# EAGLE design PCB-PWR-FP-35-1.1-in-wall-IoT-FilPilote-Power-Board (EAGLE 7.4.0)
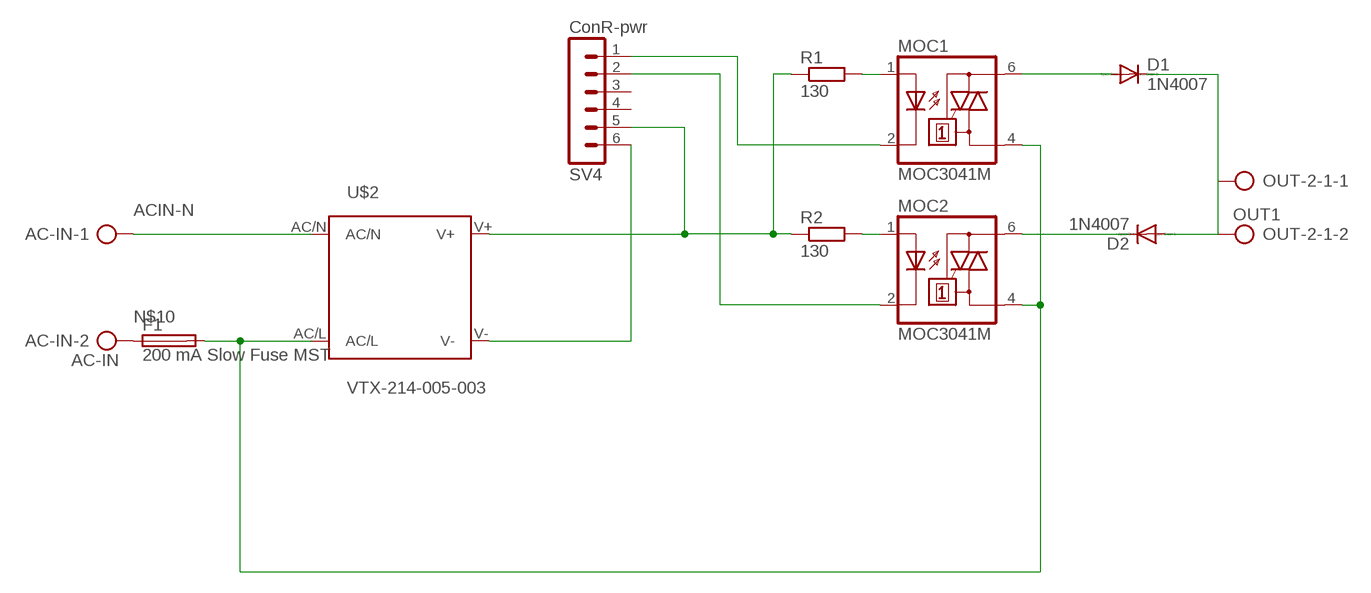
[diagram p0: schematic, sheet 1]

## Parts
AC-IN  AC-IN  AK500/2-H  [AK500/2-H]
D1  1N4007  1N4004  [DO41-10]
D2  1N4007  1N4004  [DO41-10]
F1  200 mA Slow Fuse MST  FUSETE5  [TE5]
MOC1  MOC3041M  [DIL06]
MOC2  MOC3041M  [DIL06]
OUT-2-1  OUT1  AK500/2-H  [AK500/2-H]
R1  130  R-EU_R1206W  [R1206W]
R2  130  R-EU_R1206W  [R1206W]
SV4  ConR-pwr  MA06-1  [MA06-1]
U$2  VTX-214-005-003  [VTX-214-005-003]

## Nets
ACIN-L: F1.2 MOC1.4(A1) MOC2.4(A1) U$2.AC/L
ACIN-N: AC-IN.1 U$2.AC/N
N$1: D1.C D2.A OUT-2-1.1 OUT-2-1.2
N$3: D1.A MOC1.6(A2)
N$4: SV4.6 U$2.V-
N$5: D2.C MOC2.6(A2)
N$6: MOC1.2(C) SV4.1
N$7: MOC2.2(C) SV4.2
N$8: MOC1.1(A) R1.2
N$9: MOC2.1(A) R2.2
N$10: AC-IN.2 F1.1
N$19: R1.1 R2.1 SV4.5 U$2.V+
Unconnected: SV4.3 SV4.4

## Library data of the parts
AC-IN OUT-2-1 = con-ptr500:AK500/2-H: CONNECTOR Aug. 2004 / PTR Meßtechnik: Die Bezeichnung der Serie AK505 wurde geändert. Es handelt sich hierbei um AK500 in horizontaler Ausführung.; OC_FARNELL: unknown; OC_NEWARK: unknown
D1 D2 = diode:1N4004: DIODE general purpose rectifier, 1 A
F1 = fuse:FUSE: Fuse; OC_FARNELL: unknown; OC_NEWARK: unknown
MOC1 MOC2 = optocoupler:MOC30*: 6-Pin DIP Zero-Cross Optoisolators Triac Driver Output (250/400 Volt Peak) Source: Data sheet <http://www.fairchildsemi.com/ds/MO/MOC3031M.pdf> The old path of data sheet not more available 2013-05-06.; MF: FAIRCHILD SEMICONDUCTOR; MPN: MOC3041M; OC_FARNELL: 1086677; OC_NEWARK: 78K6090
R1 R2 = resistor:R-EU_: RESISTOR, European symbol
SV4 = con-lstb:MA06-1: PIN HEADER; OC_FARNELL: unknown; OC_NEWARK: unknown
U$2 = VTX-214-005-003 - TMPS 03 103:VTX-214-005-003: 5 watt 3.3v 1500mA

## Board
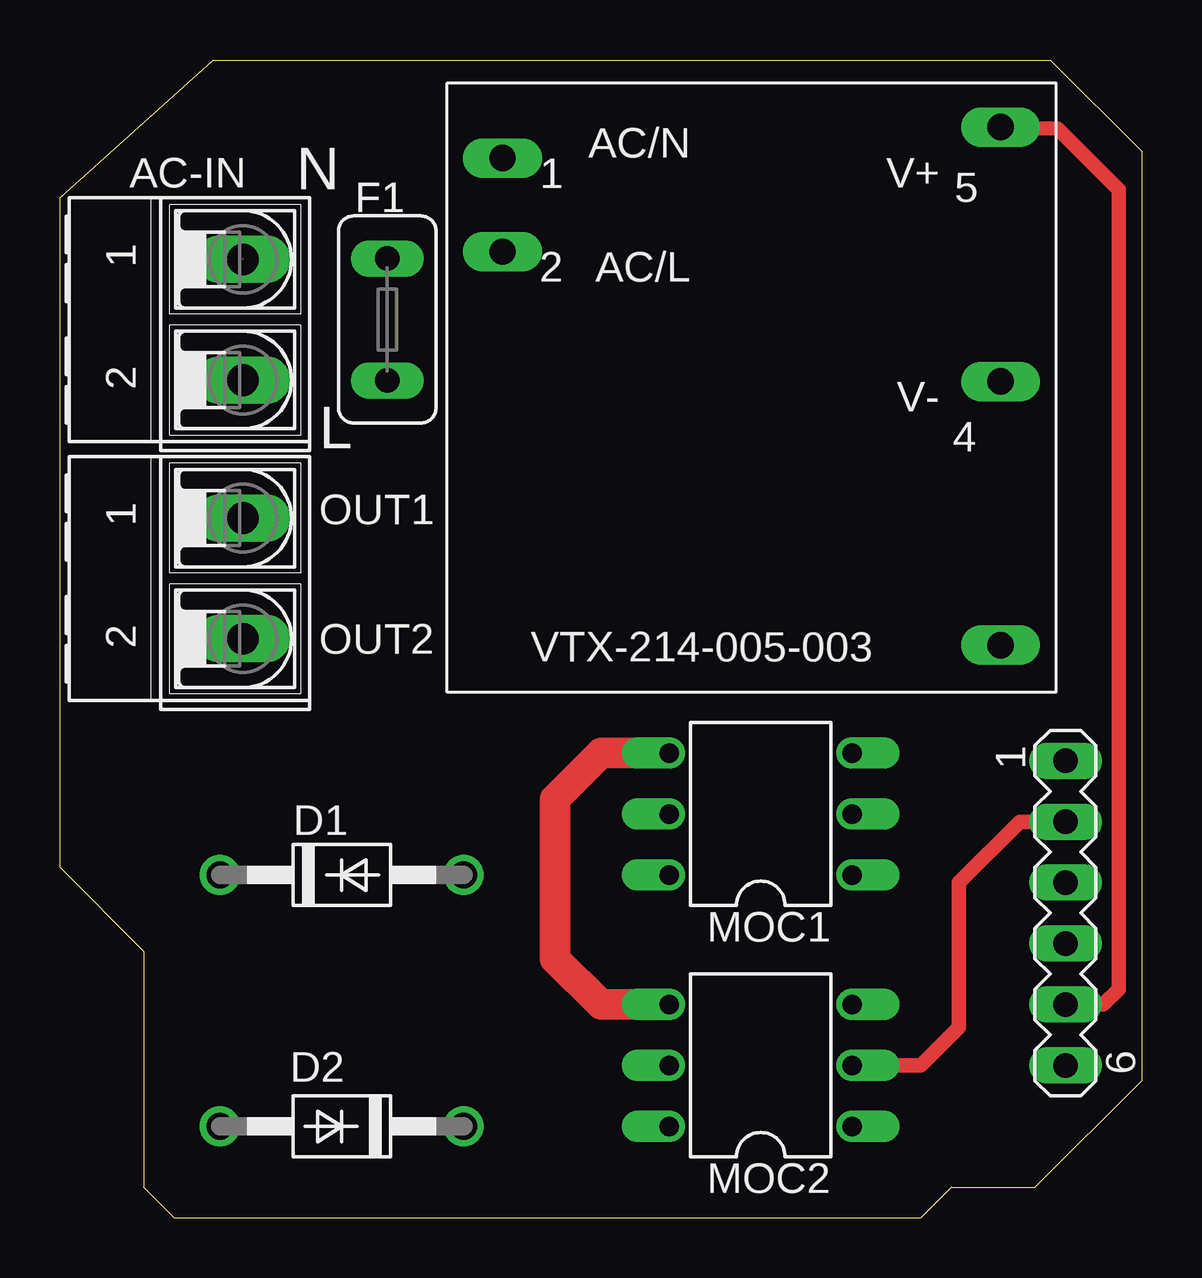
[diagram p1: board, top side]
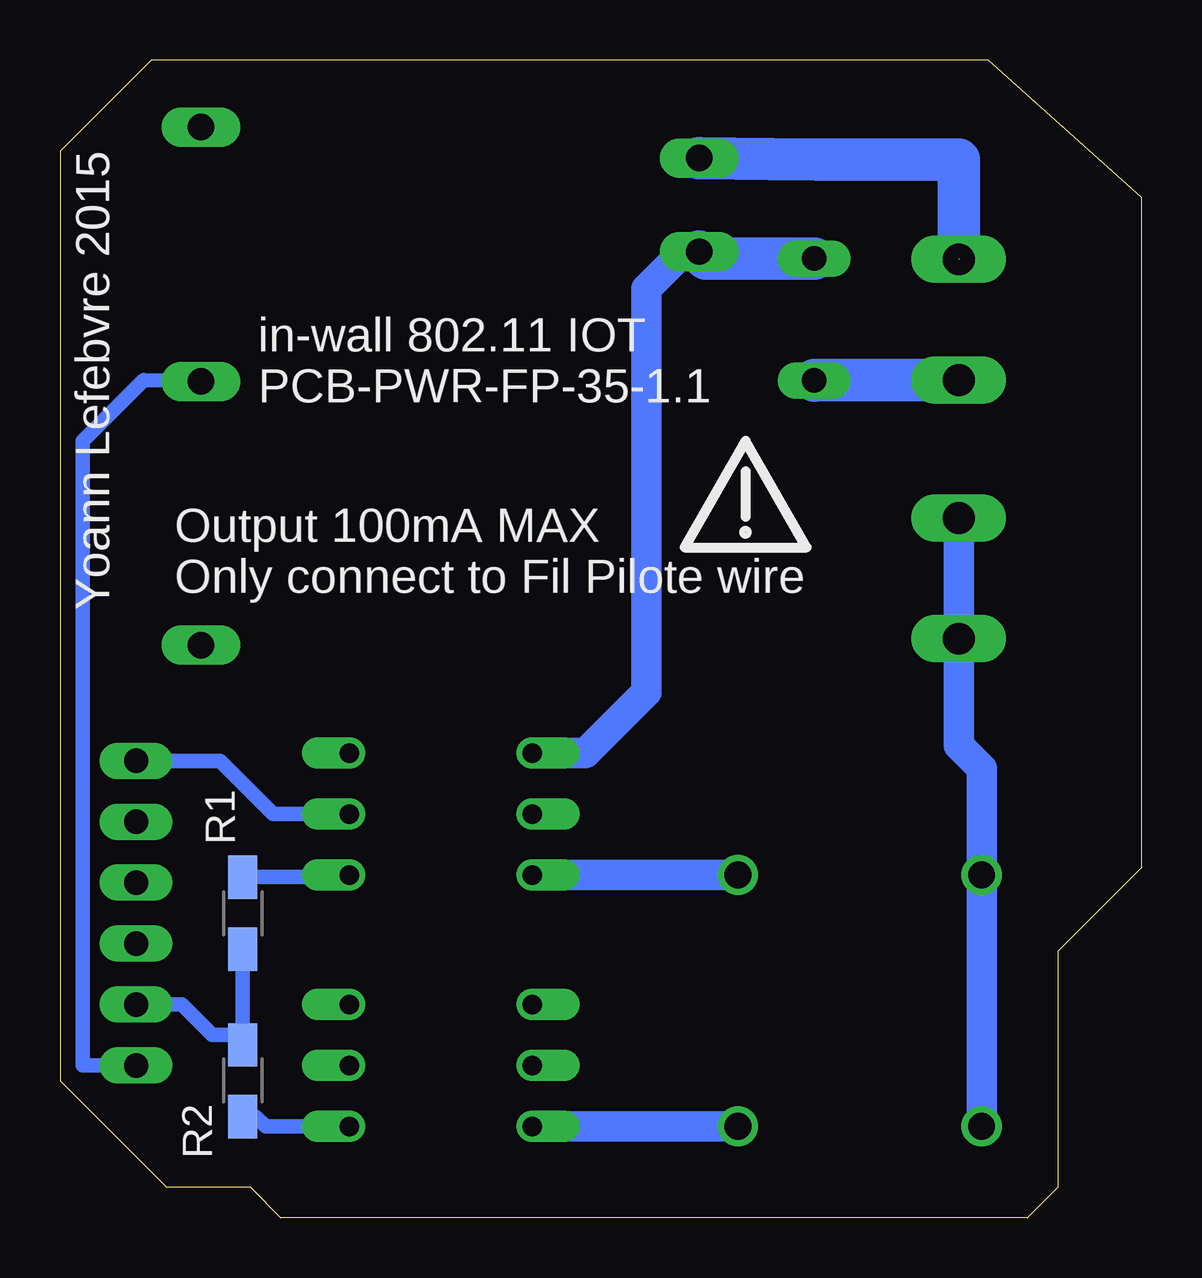
[diagram p2: board, bottom side, seen from below]

Size 45.09 x 48.26 mm. Coordinates in mm from the lower left corner, seen from the top.
Outline: 6.39,48.26 41.27,48.26 45.09,44.45 45.09,5.71 40.64,1.27 37.15,1.27 35.88,0 4.76,0 3.49,1.27 3.49,11.11 0,14.61 0,42.52 6.39,48.26
Copper layers (1*16): Top 0.035mm / dielectric 1.5mm / Bottom 0.035mm
Design rules "dirt_cheap_dirty_boards.v1": minimum track width 5mil, minimum drill 12mil, track to track 5mil, track to pad 5mil, pad to pad 5mil, via to via 5mil, smd to smd 0mil, copper to edge 10mil, drill to drill 10mil, minimum pad ring 10mil, minimum via ring 6mil, stop-mask expansion 2mil, vias tented up to drill 25mil, thermal gap 10mil

### Footprints (pad centres in the part's own frame; a part is rotated, then mirrored left to right if it is on the bottom)
AK500/2-H = drill 1.321 long: 1 -2.515,0; 2 2.515,0
DO41-10 = drill 1.118: A 5.08,0; C -5.08,0
TE5 = drill 1.016 long: 1 -2.54,0; 2 2.54,0
DIL06 = drill 0.813 offset: 1 -2.54,-3.81; 2 0,-3.81; 3 2.54,-3.81; 4 2.54,3.81; 5 0,3.81; 6 -2.54,3.81
R1206W = smd 1.8 x 1.2: 1 -1.499,0; 2 1.499,0
MA06-1 = drill 1.016 long: 1 -6.35,0; 2 -3.81,0; 3 -1.27,0; 4 1.27,0; 5 3.81,0; 6 6.35,0
VTX-214-005-003 = drill 1.1 pad 1.422 long: AC/L 10.38,-5.67; AC/N 10.38,-9.57 | drill 1.1 long: NC -10.38,10.73; V+ -10.38,-10.86; V- -10.38,-0.26

### Placement (x,y rotation side)
AC-IN  7.62,37.43 270 top
D1  11.75,14.29 0 top
D2  11.75,3.81 180 top
F1  13.64,37.44 90 top
MOC1  29.21,16.83 90 top
MOC2  29.21,6.35 90 top
OUT-2-1  7.62,26.65 270 top
R1  37.46,12.7 90 bottom
R2  37.46,5.71 270 bottom
SV4  41.91,12.7 270 top
U$2  28.83,34.6 180 top

### Tracks (layer width: path | path; a pad name or v marks a point on that pad's centre or on a via)
ACIN-L
  Top 1.27: MOC1.4 22.54,19.37 20.64,17.46 20.64,10.79 22.54,8.89 MOC2.4
  Bottom 1.016: U$2.AC/L 19.1,40.27
  Bottom 1.27: 19.1,40.27 20.64,38.74 20.64,21.91 23.18,19.37 MOC1.4
  Bottom 1.778: F1.2 18.16,39.99 U$2.AC/L
ACIN-N  (1 unrouted)
  Bottom 1.778: 7.62,39.98 7.62,44.1 13.5,44.1 15.41,44.13 U$2.AC/N
N$1
  Bottom 1.27: D2.A D1.C 6.67,18.73 7.62,19.68 OUT-2-1.2 OUT-2-1.1
N$3
  Bottom 1.27: MOC1.6 D1.A
N$4
  Bottom 0.61: U$2.V- 41.6,34.92 44.13,32.38 44.13,6.35 SV4.6
N$5
  Bottom 1.27: MOC2.6 D2.C
N$6
  Bottom 0.61: MOC1.2 36.2,16.83 38.42,19.05 SV4.1
N$7
  Top 0.61: MOC2.2 35.88,6.35 37.46,7.94 37.46,13.97 40.01,16.51 SV4.2
N$8
  Bottom 0.61: R1.2 33.11,14.2 MOC1.1
N$9
  Bottom 0.61: R2.2 36.92,4.22 36.51,3.81 MOC2.1
N$10
  Bottom 1.778: AC-IN.2 13.63,34.92 F1.1
N$19
  Top 0.61: U$2.V+ 41.6,45.4 44.13,42.86 44.13,9.53 43.5,8.89 SV4.5
  Bottom 0.61: SV4.5 40.01,8.89 38.73,7.62 37.87,7.62 R2.1 R1.1

### Text on the board
tNames: N | L | OUT1 | OUT2
bNames: Yoann Lefebvre 2015 | in-wall 802.11 IOT / PCB-PWR-FP-35-1.1 | Output 100mA MAX / Only connect to Fil Pilote wire